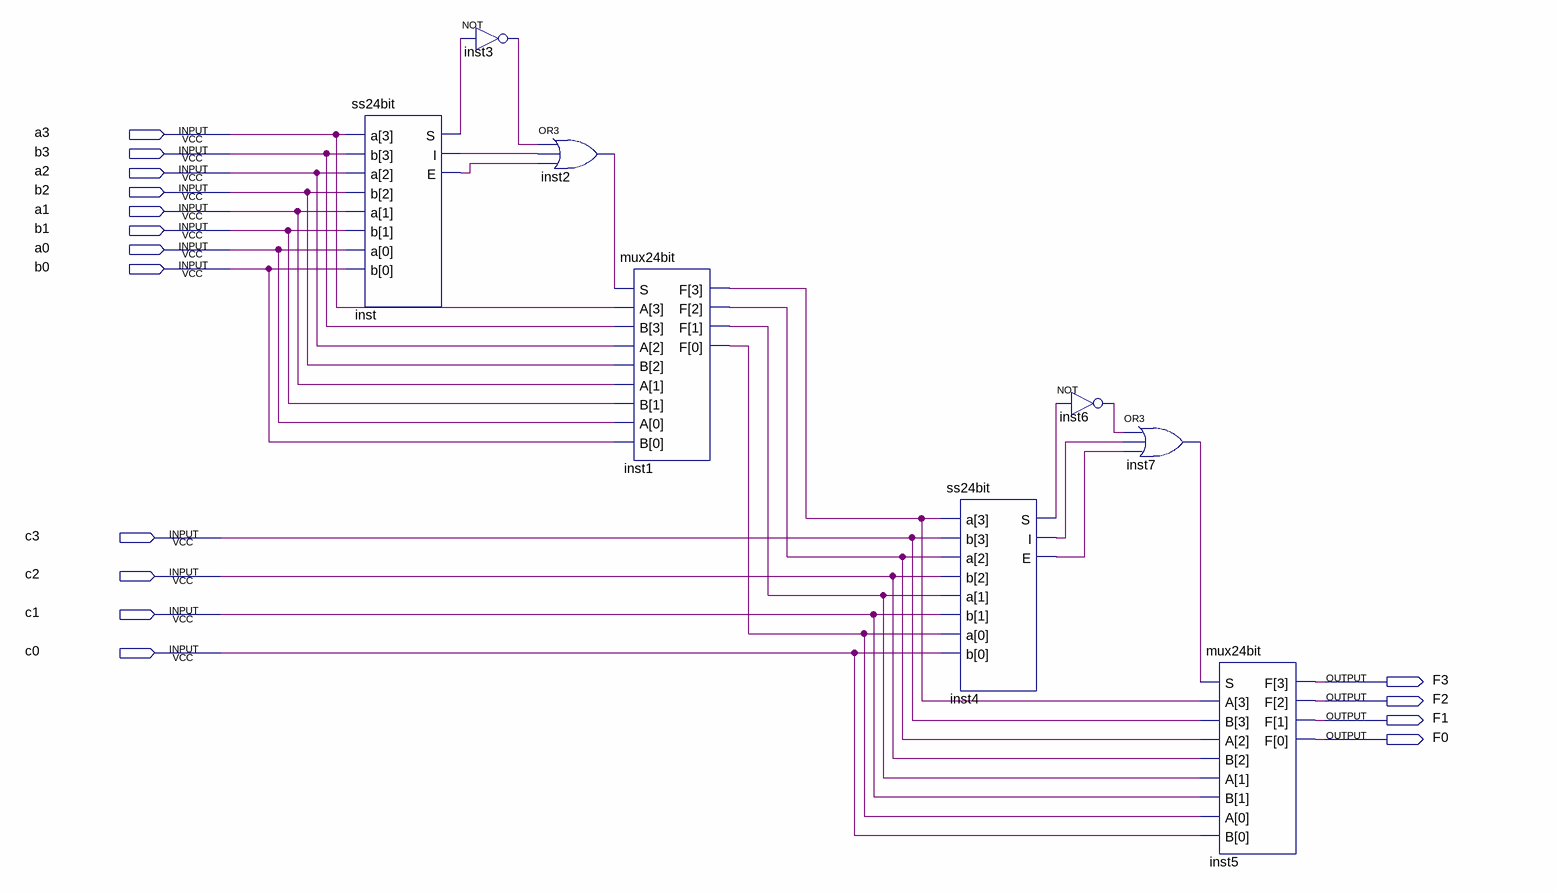
[diagram p0: schematic sheet]
// Quartus schematic cau2.bdf as structural Verilog: 8 symbols, 16 pins
module cau2 (
  input  a3,
  input  b3,
  input  a2,
  input  b2,
  input  a1,
  input  b1,
  input  a0,
  input  b0,
  input  c3,
  input  c2,
  input  c1,
  input  c0,
  output F3,
  output F2,
  output F1,
  output F0
);

  wire inst1_f, inst1_f_2, inst1_f_3, inst1_f_4, inst2_out, inst3_out, inst4_e, inst4_i, inst4_s, inst6_out,
       inst7_out, inst_e, inst_i, inst_s;

  ss24bit inst (.a({a3, a2, a1, a0}), .b({b3, b2, b1, b0}), .S(inst_s), .I(inst_i), .E(inst_e));
  not inst3 (inst3_out, inst_s);
  or inst2 (inst2_out, inst3_out, inst_i, inst_e);
  mux24bit inst1 (
    .S(inst2_out), .A({a3, a2, a1, a0}), .B({b3, b2, b1, b0}), .F({inst1_f_4, inst1_f_3, inst1_f_2, inst1_f}));
  ss24bit inst4 (
    .a({inst1_f_4, inst1_f_3, inst1_f_2, inst1_f}), .b({c3, c2, c1, c0}), .S(inst4_s), .I(inst4_i),
    .E(inst4_e));
  not inst6 (inst6_out, inst4_s);
  or inst7 (inst7_out, inst6_out, inst4_i, inst4_e);
  mux24bit inst5 (
    .S(inst7_out), .A({inst1_f_4, inst1_f_3, inst1_f_2, inst1_f}), .B({c3, c2, c1, c0}), .F({F3, F2, F1, F0}));
endmodule
